# EAGLE design Adafruit RS232 Pal (EAGLE 9.6.2)
COMPANY: ADAFRUIT INDUSTRIES; DRAWN: KTOWN; REV: B
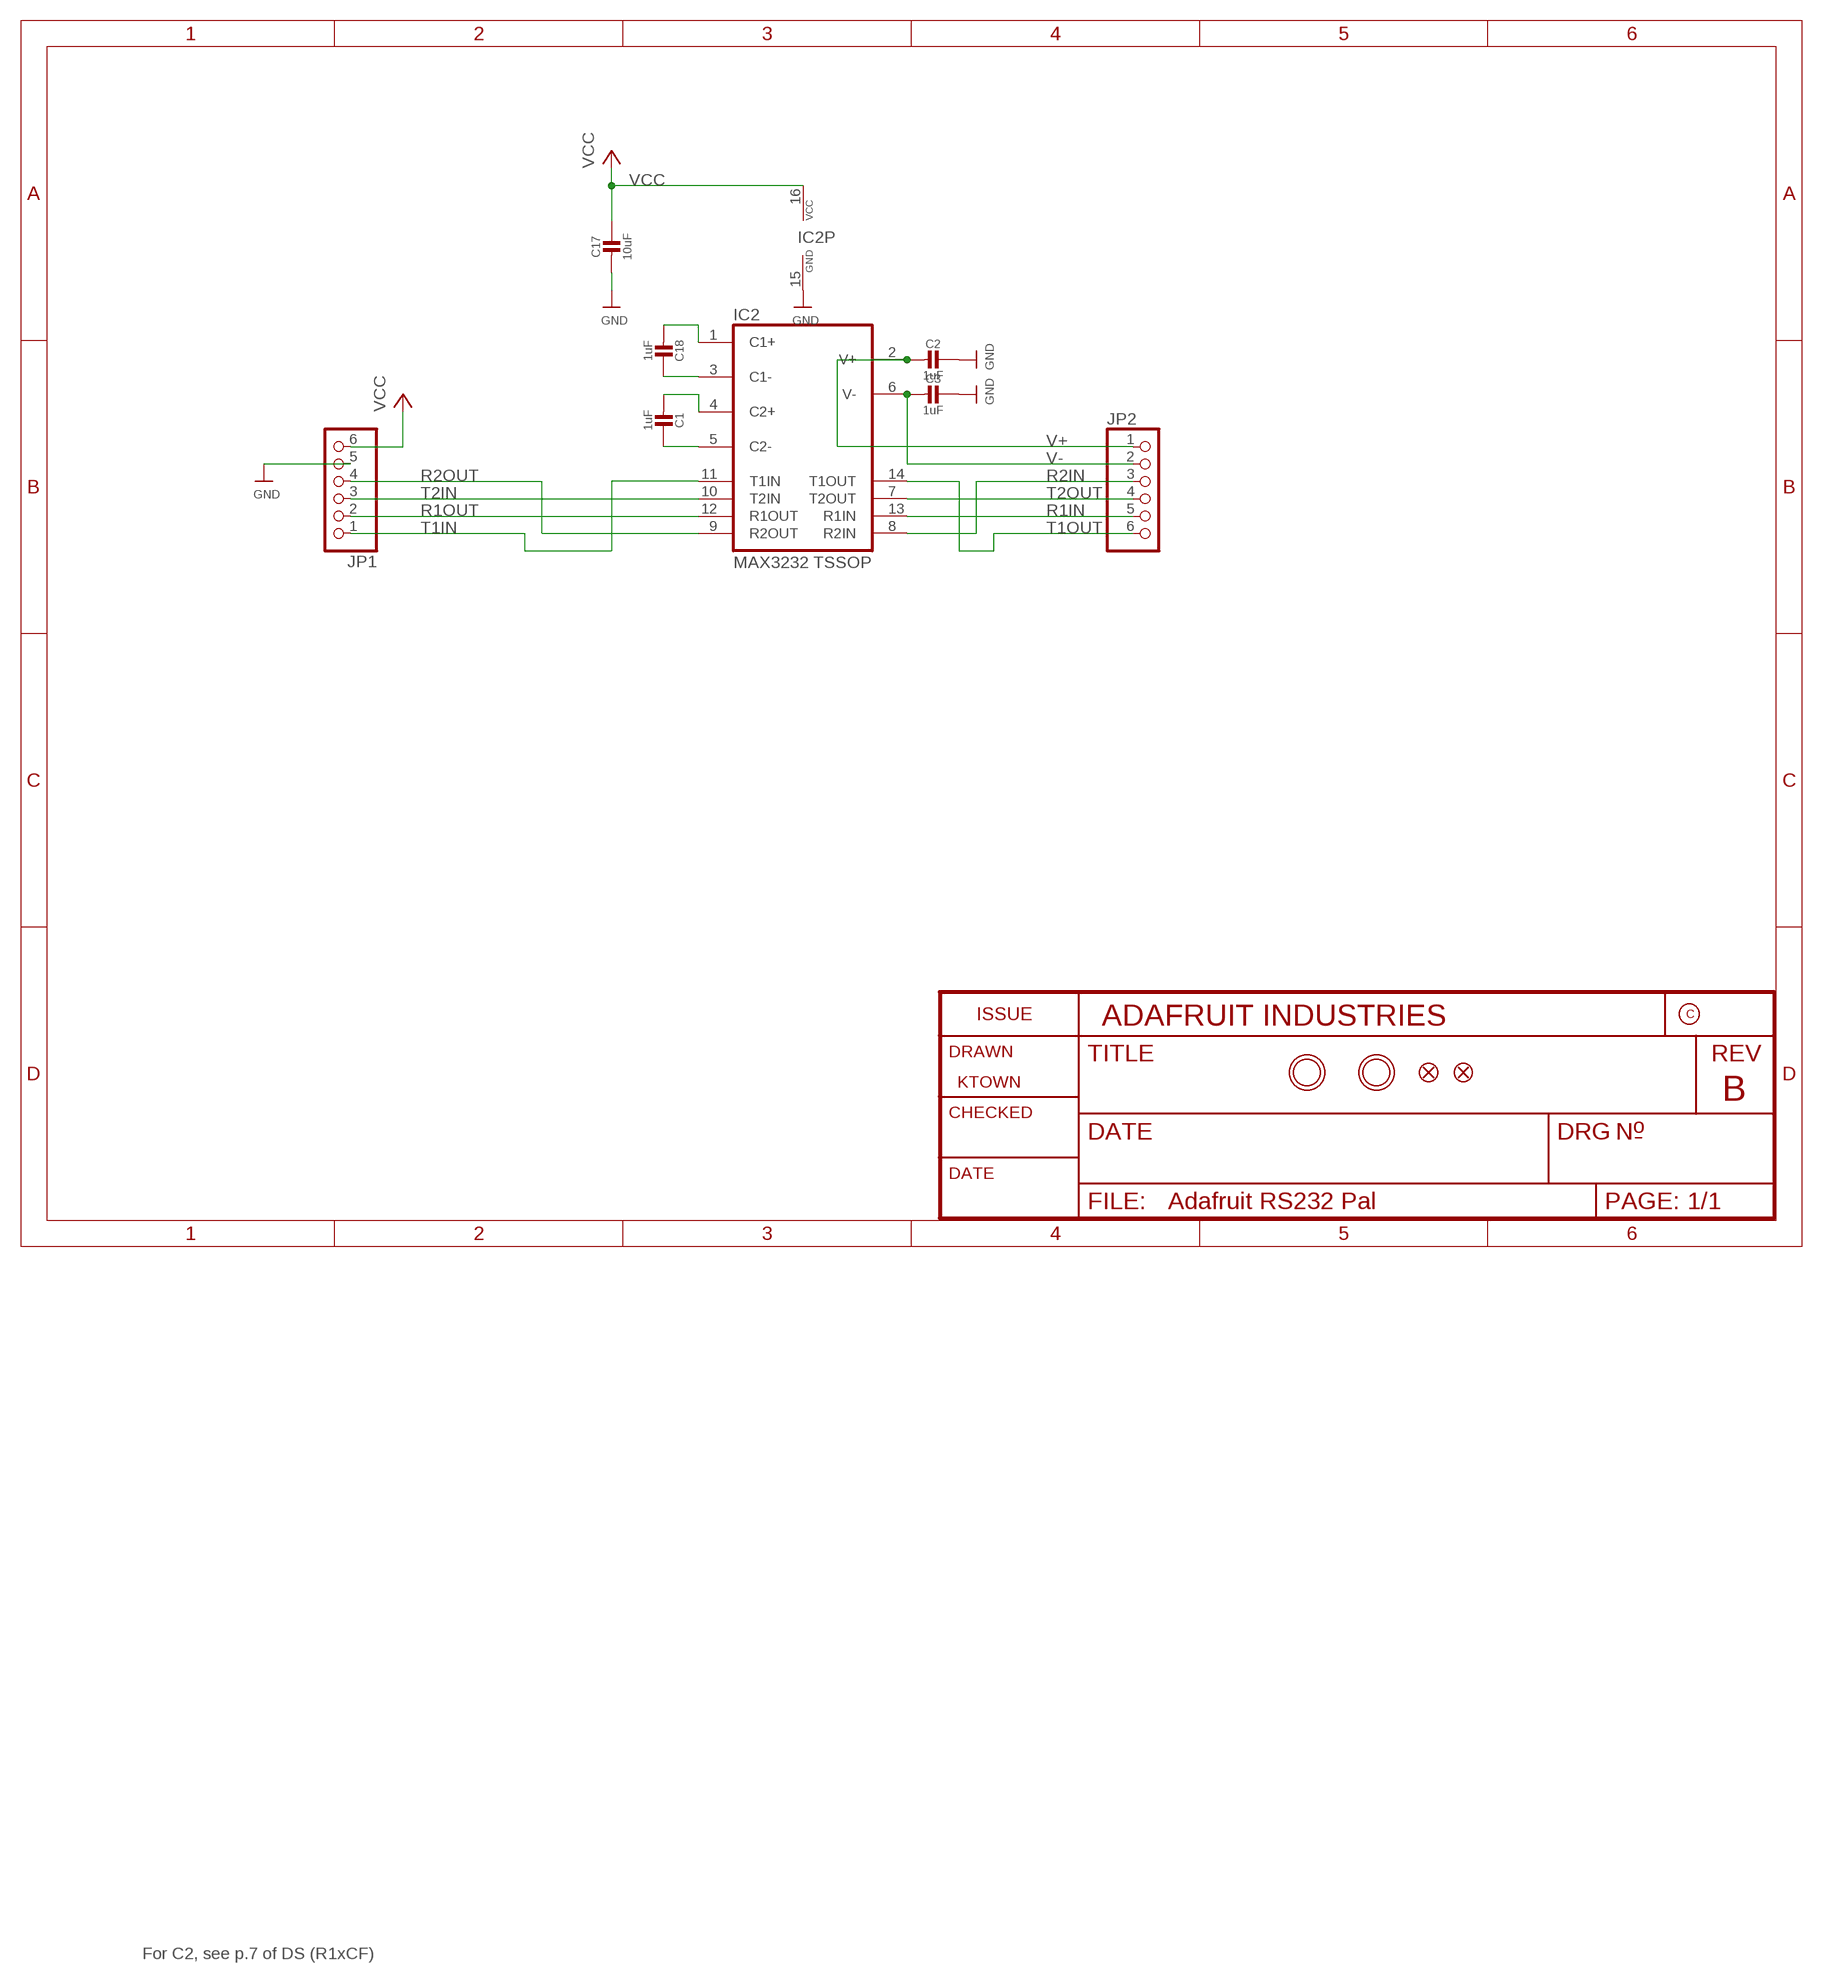
[diagram p0: schematic, sheet 1]

## Parts
C1  1uF  CAP_CERAMIC0603_NO  [0603-NO]
C2  1uF  CAP_CERAMIC0603_NO  [0603-NO]
C3  1uF  CAP_CERAMIC0603_NO  [0603-NO]
C17  10uF  CAP_CERAMIC0805-NOOUTLINE  [0805-NO]
C18  1uF  CAP_CERAMIC0603_NO  [0603-NO]
FID1  FIDUCIAL_0.5MM  [FIDUCIAL_0.5MM]
FID2  FIDUCIAL_0.5MM  [FIDUCIAL_0.5MM]
IC2  MAX3232 TSSOP  MAX3232CUE  [TSSOP16]
JP1  HEADER-1X670MIL  [1X06_ROUND_70]
JP2  HEADER-1X670MIL  [1X06_ROUND_70]
U$2  MOUNTINGHOLE2.5  [MOUNTINGHOLE_2.5_PLATED]
U$3  MOUNTINGHOLE2.5  [MOUNTINGHOLE_2.5_PLATED]

## Nets
GND [gnd]: C2.1 C3.1 C17.2 IC2.15(GND) JP1.5
N$1: C18.2 IC2.1(C1+)
N$2: C18.1 IC2.3(C1-)
N$3: C1.1 IC2.5(C2-)
N$4: C1.2 IC2.4(C2+)
R1IN: IC2.13(R1IN) JP2.5
R1OUT: IC2.12(R1OUT) JP1.2
R2IN: IC2.8(R2IN) JP2.3
R2OUT: IC2.9(R2OUT) JP1.4
T1IN: IC2.11(T1IN) JP1.1
T1OUT: IC2.14(T1OUT) JP2.6
T2IN: IC2.10(T2IN) JP1.3
T2OUT: IC2.7(T2OUT) JP2.4
V+: C2.2 IC2.2(V+) JP2.1
V-: C3.2 IC2.6(V-) JP2.2
VCC: C17.1 IC2.16(VCC) JP1.6

## Notes on the sheet
- For C2, see p.7 of DS (R1xCF)

## Library data of the parts
C1-C3 C17 C18 = microbuilder:CAP_CERAMIC: Ceramic Capacitors For new designs, use the packages preceded by an '_' character since they are more reliable: The following footprints should be used on most boards: _0402 - Standard footprint for regular board layouts _0603 - Standard footprint for regular board layouts _0805 - Standard footprint for regular board layouts _1206 - Standard footprint for regular board layouts For extremely tight-pitch boards where space is at a premium, the following 'micro-pitch' footprints can be used (smaller pads, no silkscreen outline, etc.): _0402MP - Micro-pitch footprint for very dense/compact boards _0603MP - Micro-pitch footprint for very dense/compact boards _0805MP - Micro-pitch footprint for very dense/compact boards _1206MP - Micro-pitch footprint for very dense/compact boards
FID1 FID2 = microbuilder:FIDUCIAL: Fiducial Alignment Points Various fiducial points for machine vision alignment.
IC2 = maxim:MAX3232*: True RS-232 Transceivers 3.0V to 5.5V, Low-Power up to 1Mbps, Using Four 0.1µF External Capacitors Source: http://pdfserv.maxim-ic.com/en/ds/MAX3222-MAX3241.pdf; MF: MAXIM; MPN: MAX3232CUE+; OC_FARNELL: 1593350; OC_NEWARK: 68K4629
JP1 JP2 = microbuilder:HEADER-1X6: PIN HEADER
U$2 U$3 = microbuilder:MOUNTINGHOLE: Mounting Hole For #2 screws (0.086"/2.18mm width, 0.094"/2.4mm hole) use 2.5mm; BOM: EXCLUDE

## Net classes
1 power: width 0.254 mm
2 gnd: width 0.254 mm

## Board
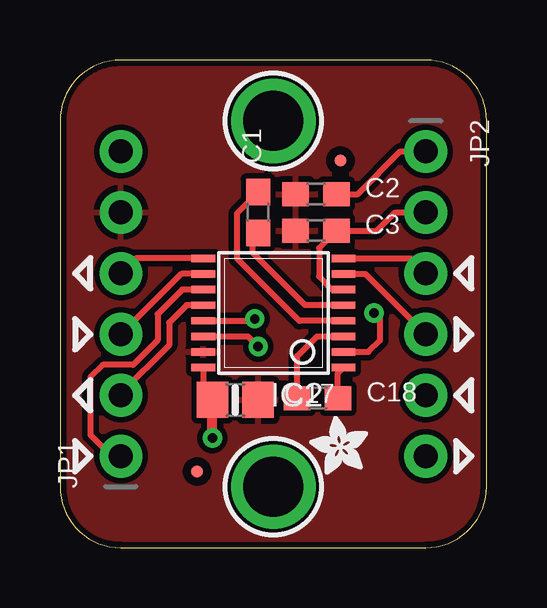
[diagram p1: board, top side]
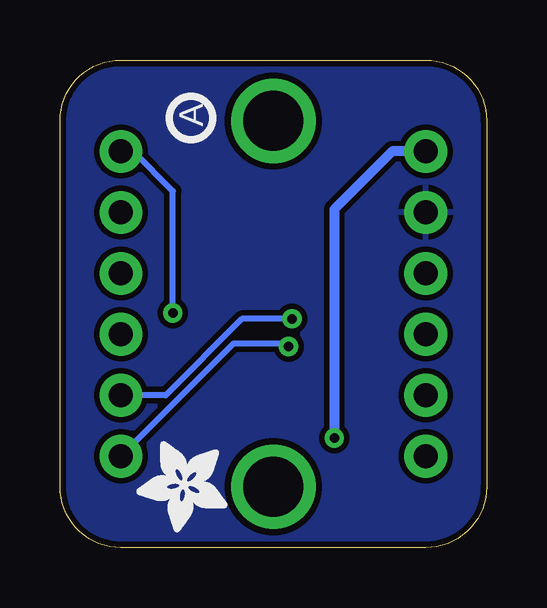
[diagram p2: board, bottom side, seen from below]

Size 17.78 x 20.32 mm. Coordinates in mm from the lower left corner, seen from the top.
Outline: 15.24,20.32 2.54,20.32 arc90 0,17.78 0,2.54 arc90 2.54,0 15.24,0 arc90 17.78,2.54 17.78,17.78 arc90 15.24,20.32
Copper layers (1*16): Top 0.035mm / dielectric 1.5mm / Bottom 0.035mm
Design rules "adafruit *": minimum track width 8mil, minimum drill 15.5mil, track to track 9mil, track to pad 8mil, pad to pad 8mil, via to via 8mil, smd to smd 8mil, copper to edge 10mil, drill to drill 8mil, minimum pad ring 10mil, minimum via ring 8mil, stop-mask expansion 2mil, vias tented up to drill 20mil, thermal gap 10mil

### Footprints (pad centres in the part's own frame; a part is rotated, then mirrored left to right if it is on the bottom)
0603-NO = smd 1.1 x 1: 1 -0.85,0; 2 0.85,0
0805-NO = smd 1.3 x 1.5: 1 -0.95,0; 2 0.95,0
FIDUCIAL_0.5MM = smd 0.5 x 0.5: 1 0,0
TSSOP16 = smd 0.305 x 0.991: 1 -2.275,-2.918; 2 -1.625,-2.918; 3 -0.975,-2.918; 4 -0.325,-2.918; 5 0.325,-2.918; 6 0.975,-2.918; 7 1.625,-2.918; 8 2.275,-2.918; 9 2.275,2.918; 10 1.625,2.918; 11 0.975,2.918; 12 0.325,2.918; 13 -0.325,2.918; 14 -0.975,2.918; 15 -1.625,2.918; 16 -2.275,2.918
1X06_ROUND_70 = drill 1 pad 1.778: 1 -6.35,0; 2 -3.81,0; 3 -1.27,0; 4 1.27,0; 5 3.81,0; 6 6.35,0
MOUNTINGHOLE_2.5_PLATED = drill 2.5 pad 3.2: P$1 0,0

### Placement (x,y rotation side)
C1  8.26,13.97 90 top
C2  10.67,14.73 0 top
C3  10.67,13.21 0 top
C17  7.3,6.16 0 top
C18  10.73,6.22 0 top
FID1  11.68,16.13 0 top
FID2  5.71,3.17 0 top
IC2  8.89,9.78 90 top
JP1  2.54,10.16 90 top
JP2  15.24,10.16 270 top
PLABEL0  [PLABEL0]  4.7,16.64 0 top
PLABEL1  [PLABEL1]  5.33,13.97 0 top
PLABEL2  [PLABEL2]  4.19,11.43 90 top
PLABEL3  [PLABEL3]  4.19,8.89 90 top
PLABEL4  [PLABEL4]  4.19,6.22 90 top
PLABEL5  [PLABEL5]  4.19,3.68 90 top
PLABEL6  [PLABEL6]  13.21,16.51 0 top
PLABEL7  [PLABEL7]  13.46,11.3 90 top
PLABEL8  [PLABEL8]  13.46,8.76 90 top
PLABEL9  [PLABEL9]  13.46,6.1 90 top
PLABEL10  [PLABEL10]  13.46,3.68 90 top
PLABEL11  [PLABEL11]  13.34,13.97 0 top
PLABEL12  [PLABEL12]  13.97,18.92 0 top
PLABEL13  [PLABEL13]  4.06,18.8 0 top
PLABEL14  [PLABEL14]  3.68,1.65 0 top
PLABEL15  [PLABEL15]  14.1,1.78 0 top
PLABEL16  [PLABEL16]  9.4,10.29 90 bottom
PLABEL17  [PLABEL17]  4.57,10.03 90 bottom
U$2  8.89,17.78 270 top
U$3  8.89,2.54 270 top
U$5  [PCBFEAT-REV-040]  12.32,17.91 90 bottom
U$8  [ADAFRUIT_3.5MM]  10.79,4.45 180 bottom
U$9  [ADAFRUIT_2.5MM]  12.83,3.05 90 top

### Tracks (layer width: path | path; a pad name or v marks a point on that pad's centre or on a via)
GND
  pour Bottom: 17.78,20.32 17.78,0 0,0 0,20.32
  pour Top: 17.78,20.32 17.78,0 0,0 0,20.32
N$1
  Top 0.254: C18.2 11.58,7.28 IC2.1
N$2
  Top 0.254: C18.1 9.88,7.98 10.71,8.8 IC2.3
N$3
  Top 0.254: C1.1 8,12.87 8,12.32 10.22,10.1 IC2.5
N$4
  Top 0.254: IC2.4 9.98,9.45 7.37,12.06 7.37,13.93 C1.2
R1IN  (via drill 0.39)
  Top 0.254: IC2.13 8.04,9.45 v8.12,9.53
  Bottom 0.254: v8.12,9.53 10.2,9.53 13.38,6.35 JP2.5
R1OUT
  Top 0.254: IC2.12 5.28,10.1 4.55,9.37 4.55,8.44 2.54,6.43 JP1.2
R2IN
  Top 0.254: IC2.8 14.62,12.05 JP2.3
R2OUT
  Top 0.254: IC2.9 3.16,12.05 JP1.4
T1IN
  Top 0.254: IC2.11 5.09,10.75 4.06,9.73 4.06,8.64 3.05,7.62 1.78,7.62 1.27,7.11 1.27,4.7 2.16,3.81 JP1.1
T1OUT  (via drill 0.39)
  Top 0.254: IC2.14 7.83,8.8 v8.26,8.38
  Bottom 0.254: v8.26,8.38 8.38,8.51 10.54,8.51 JP2.6
T2IN
  Top 0.254: IC2.10 5.05,11.4 JP1.3
T2OUT
  Top 0.254: IC2.7 12.73,11.4 JP2.4
V+  (via drill 0.39)
  Top 0.254: C2.2 12.41,14.73 14.19,16.51 JP2.1 | IC2.2 12.85,8.15 13.34,8.64 13.34,9.52 v13.08,9.78
  Bottom 0.254: v13.08,9.78 13.08,14.86 14.73,16.51 JP2.1
V-
  Top 0.254: JP2.2 13.97,13.97 13.21,13.21 C3.2 10.79,12.48 10.79,11.3 11.34,10.75 IC2.6
VCC  (via drill 0.39)
  Top 0.254: IC2.16 5.97,6.54 C17.1
  Top 0.406: v6.35,4.57 C17.1
  Bottom 0.406: JP1.6 3.94,16.51 6.35,14.1 v6.35,4.57

### Text on the board
Pinguin_tBackup: UART | RS232 | Vin | V+ | GND | V- | R2 | R2 | T2 | T2 | R1 | R1 | T1 | T1 | LV Side | HV Side
Pinguin_bBackup: Vin/Vlogic: 3~5VDC | MAX3232 / RS-232 2/2 / Transceiver